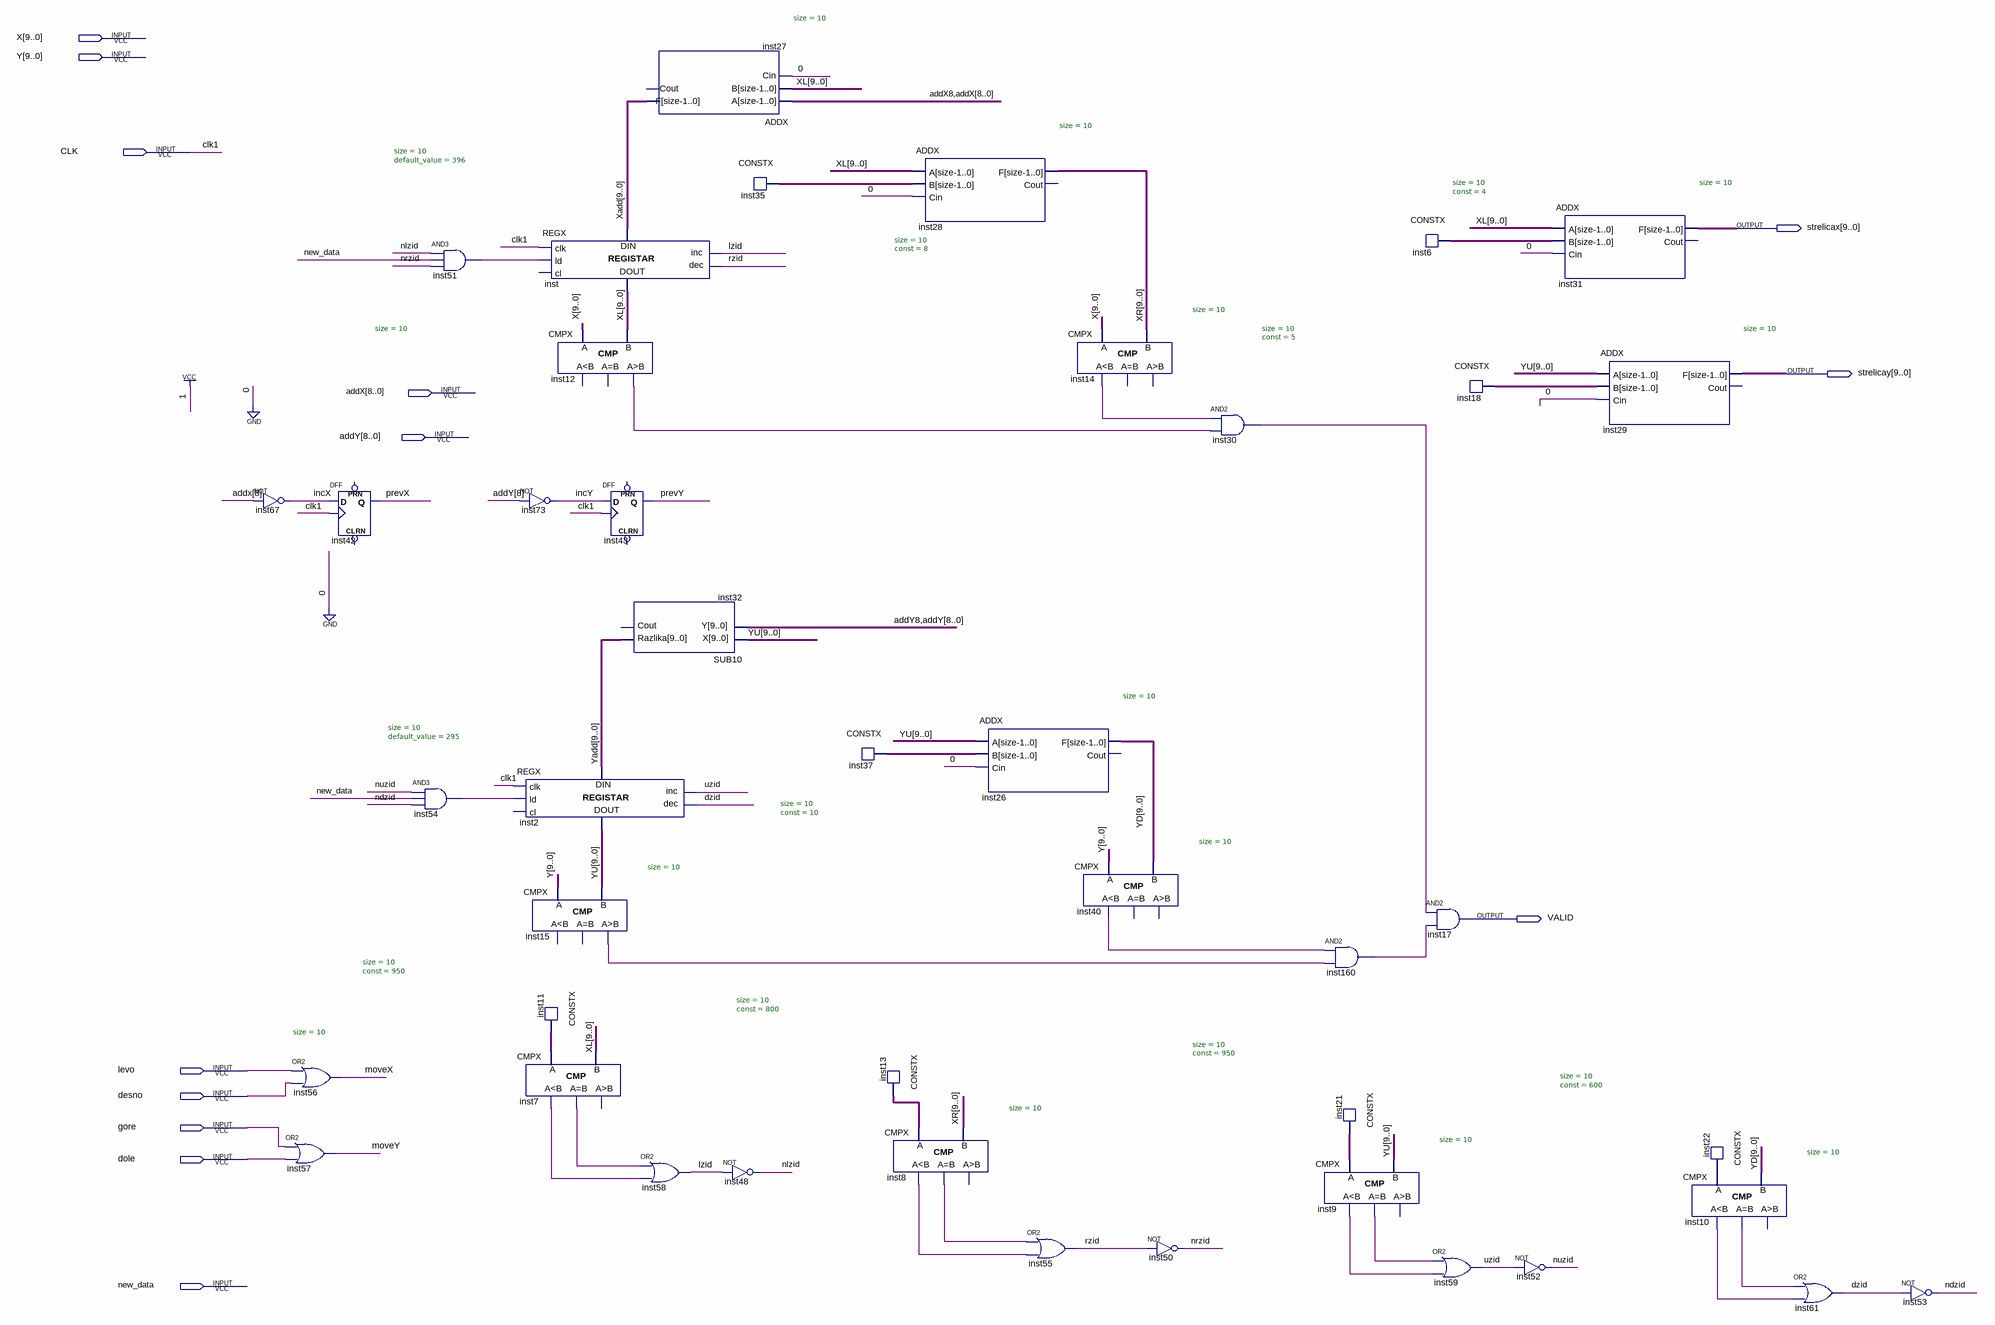
[diagram p0: schematic sheet]
// Quartus schematic strelica.bdf as structural Verilog: 43 symbols, 13 pins
module strelica (
  input  [9:0] X,
  input  [9:0] Y,
  input  CLK,
  input  [8:0] addX,
  input  [8:0] addY,
  input  levo,
  input  desno,
  input  gore,
  input  dole,
  input  new_data,
  output [9:0] strelicax,
  output [9:0] strelicay,
  output VALID
);

  wire dzid, incX, incY, inst7_eq, inst7_ls, inst8_eq, inst8_ls, inst9_eq, inst9_ls, inst10_eq, inst10_ls,
       inst12_gr, inst14_ls, inst15_gr, inst30_out, inst40_ls, inst51_out, inst54_out, inst160_out, lzid,
       moveX, moveY, ndzid, nlzid, nrzid, nuzid, prevX, prevY, rzid, uzid;
  wire [9:0] inst6_data, inst11_data, inst13_data, inst18_data, inst21_data, inst22_data, inst35_data,
       inst37_data, Xadd, XL, XR, Yadd, YD, YU;

  not inst67 (incX, addX[8]);
  DFF inst42 (.CLK(CLK), .D(incX), .Q(prevX));  // open: CLRN, PRN
  or inst56 (moveX, levo, desno);
  or inst57 (moveY, gore, dole);
  and inst51 (inst51_out, nlzid, new_data, nrzid);
  and inst54 (inst54_out, nuzid, new_data, ndzid);
  not inst73 (incY, addY[8]);
  REGX #(.size(10), .default_value(295)) inst2 (
    .clk(CLK), .ld(inst54_out), .inc(uzid), .dec(dzid), .data_in(Yadd), .data_out(YU));  // open: cl
  CMPX #(.size(10)) inst15 (.A(Y), .B(YU), .gr(inst15_gr));  // open: ls, eq
  CONSTX #(.size(10), .\const (950)) inst11 (.data(inst11_data));
  CMPX #(.size(10)) inst7 (.A(inst11_data), .B(XL), .ls(inst7_ls), .eq(inst7_eq));  // open: gr
  REGX #(.size(10), .default_value(396)) inst (
    .clk(CLK), .ld(inst51_out), .inc(lzid), .dec(rzid), .data_in(Xadd), .data_out(XL));  // open: cl
  CMPX #(.size(10)) inst12 (.A(X), .B(XL), .gr(inst12_gr));  // open: ls, eq
  DFF inst43 (.CLK(CLK), .D(incY), .Q(prevY));  // open: CLRN, PRN
  SUB10 inst32 (.X(YU), .Y({{2{addY[8]}}, addY[7:0]}), .Razlika(Yadd));  // open: Cout
  ADDX #(.size(10)) inst27 (.A({{2{addX[8]}}, addX[7:0]}), .B(XL), .Cin(1'b0), .F(Xadd));  // open: Cout
  or inst58 (lzid, inst7_eq, inst7_ls);
  CONSTX #(.size(10), .\const (8)) inst35 (.data(inst35_data));
  not inst48 (nlzid, lzid);
  CONSTX #(.size(10), .\const (10)) inst37 (.data(inst37_data));
  CONSTX #(.size(10), .\const (800)) inst13 (.data(inst13_data));
  CMPX #(.size(10)) inst8 (.A(inst13_data), .B(XR), .ls(inst8_ls), .eq(inst8_eq));  // open: gr
  ADDX #(.size(10)) inst28 (.A(XL), .B(inst35_data), .Cin(1'b0), .F(XR));  // open: Cout
  ADDX #(.size(10)) inst26 (.A(YU), .B(inst37_data), .Cin(1'b0), .F(YD));  // open: Cout
  or inst55 (rzid, inst8_eq, inst8_ls);
  CMPX #(.size(10)) inst14 (.A(X), .B(XR), .ls(inst14_ls));  // open: eq, gr
  CMPX #(.size(10)) inst40 (.A(Y), .B(YD), .ls(inst40_ls));  // open: eq, gr
  not inst50 (nrzid, rzid);
  and inst30 (inst30_out, inst14_ls, inst12_gr);
  and inst160 (inst160_out, inst40_ls, inst15_gr);
  CONSTX #(.size(10), .\const (950)) inst21 (.data(inst21_data));
  CMPX #(.size(10)) inst9 (.A(inst21_data), .B(YU), .ls(inst9_ls), .eq(inst9_eq));  // open: gr
  CONSTX #(.size(10), .\const (4)) inst6 (.data(inst6_data));
  and inst17 (VALID, inst30_out, inst160_out);
  or inst59 (uzid, inst9_eq, inst9_ls);
  CONSTX #(.size(10), .\const (5)) inst18 (.data(inst18_data));
  not inst52 (nuzid, uzid);
  ADDX #(.size(10)) inst31 (.A(XL), .B(inst6_data), .Cin(1'b0), .F(strelicax));  // open: Cout
  ADDX #(.size(10)) inst29 (.A(YU), .B(inst18_data), .Cin(1'b0), .F(strelicay));  // open: Cout
  CONSTX #(.size(10), .\const (600)) inst22 (.data(inst22_data));
  CMPX #(.size(10)) inst10 (.A(inst22_data), .B(YD), .ls(inst10_ls), .eq(inst10_eq));  // open: gr
  or inst61 (dzid, inst10_eq, inst10_ls);
  not inst53 (ndzid, dzid);

  // Other names for the same wires on the sheet: clk1 = CLK
endmodule
